# EAGLE design C-RIO_breakout (EAGLE 9.0.0)
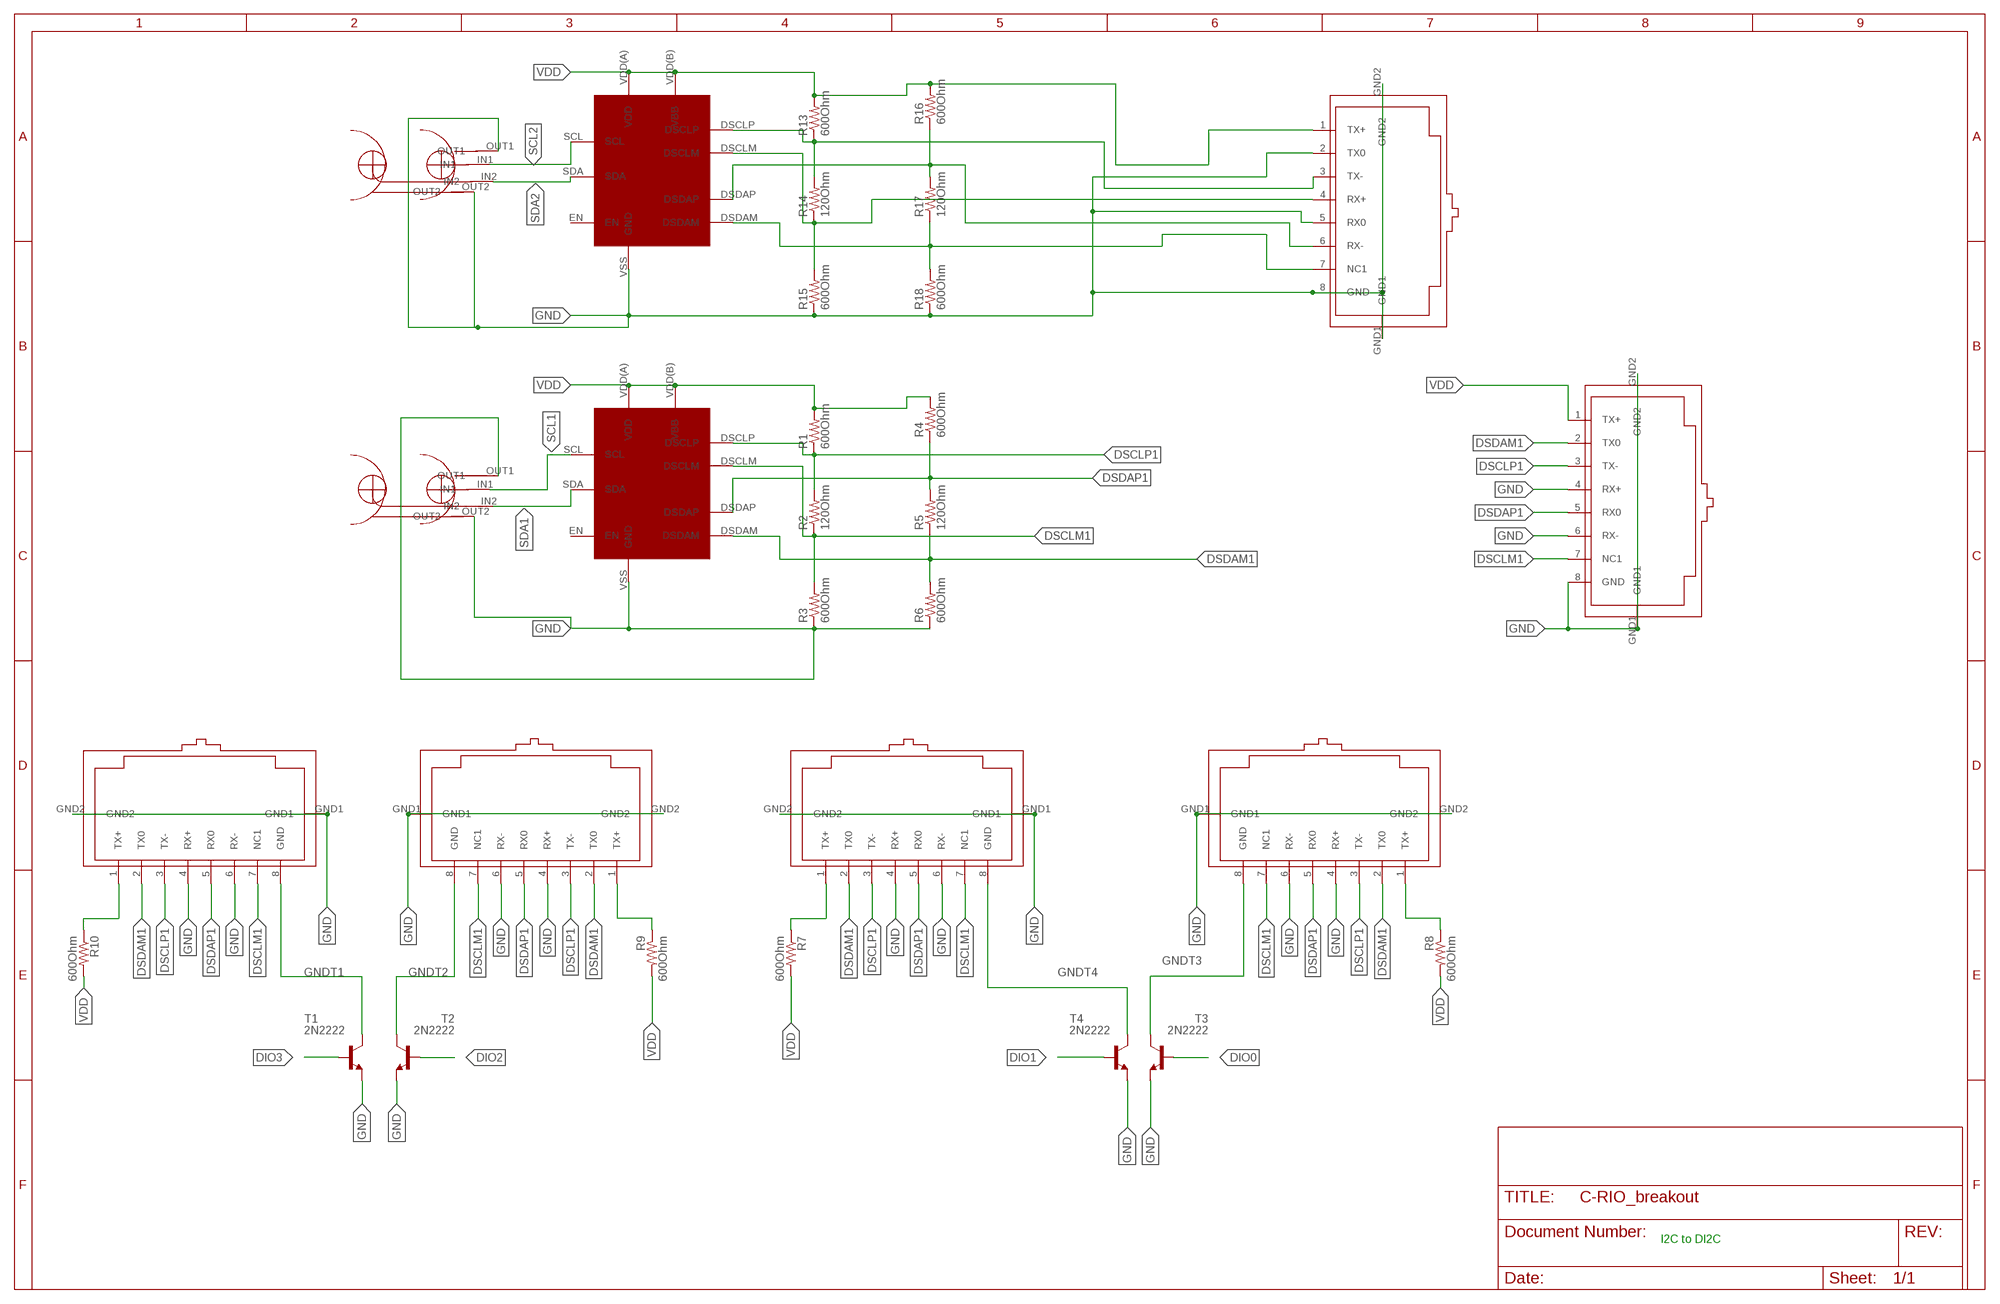
[diagram p0: schematic, sheet 1, part 1 of 2]
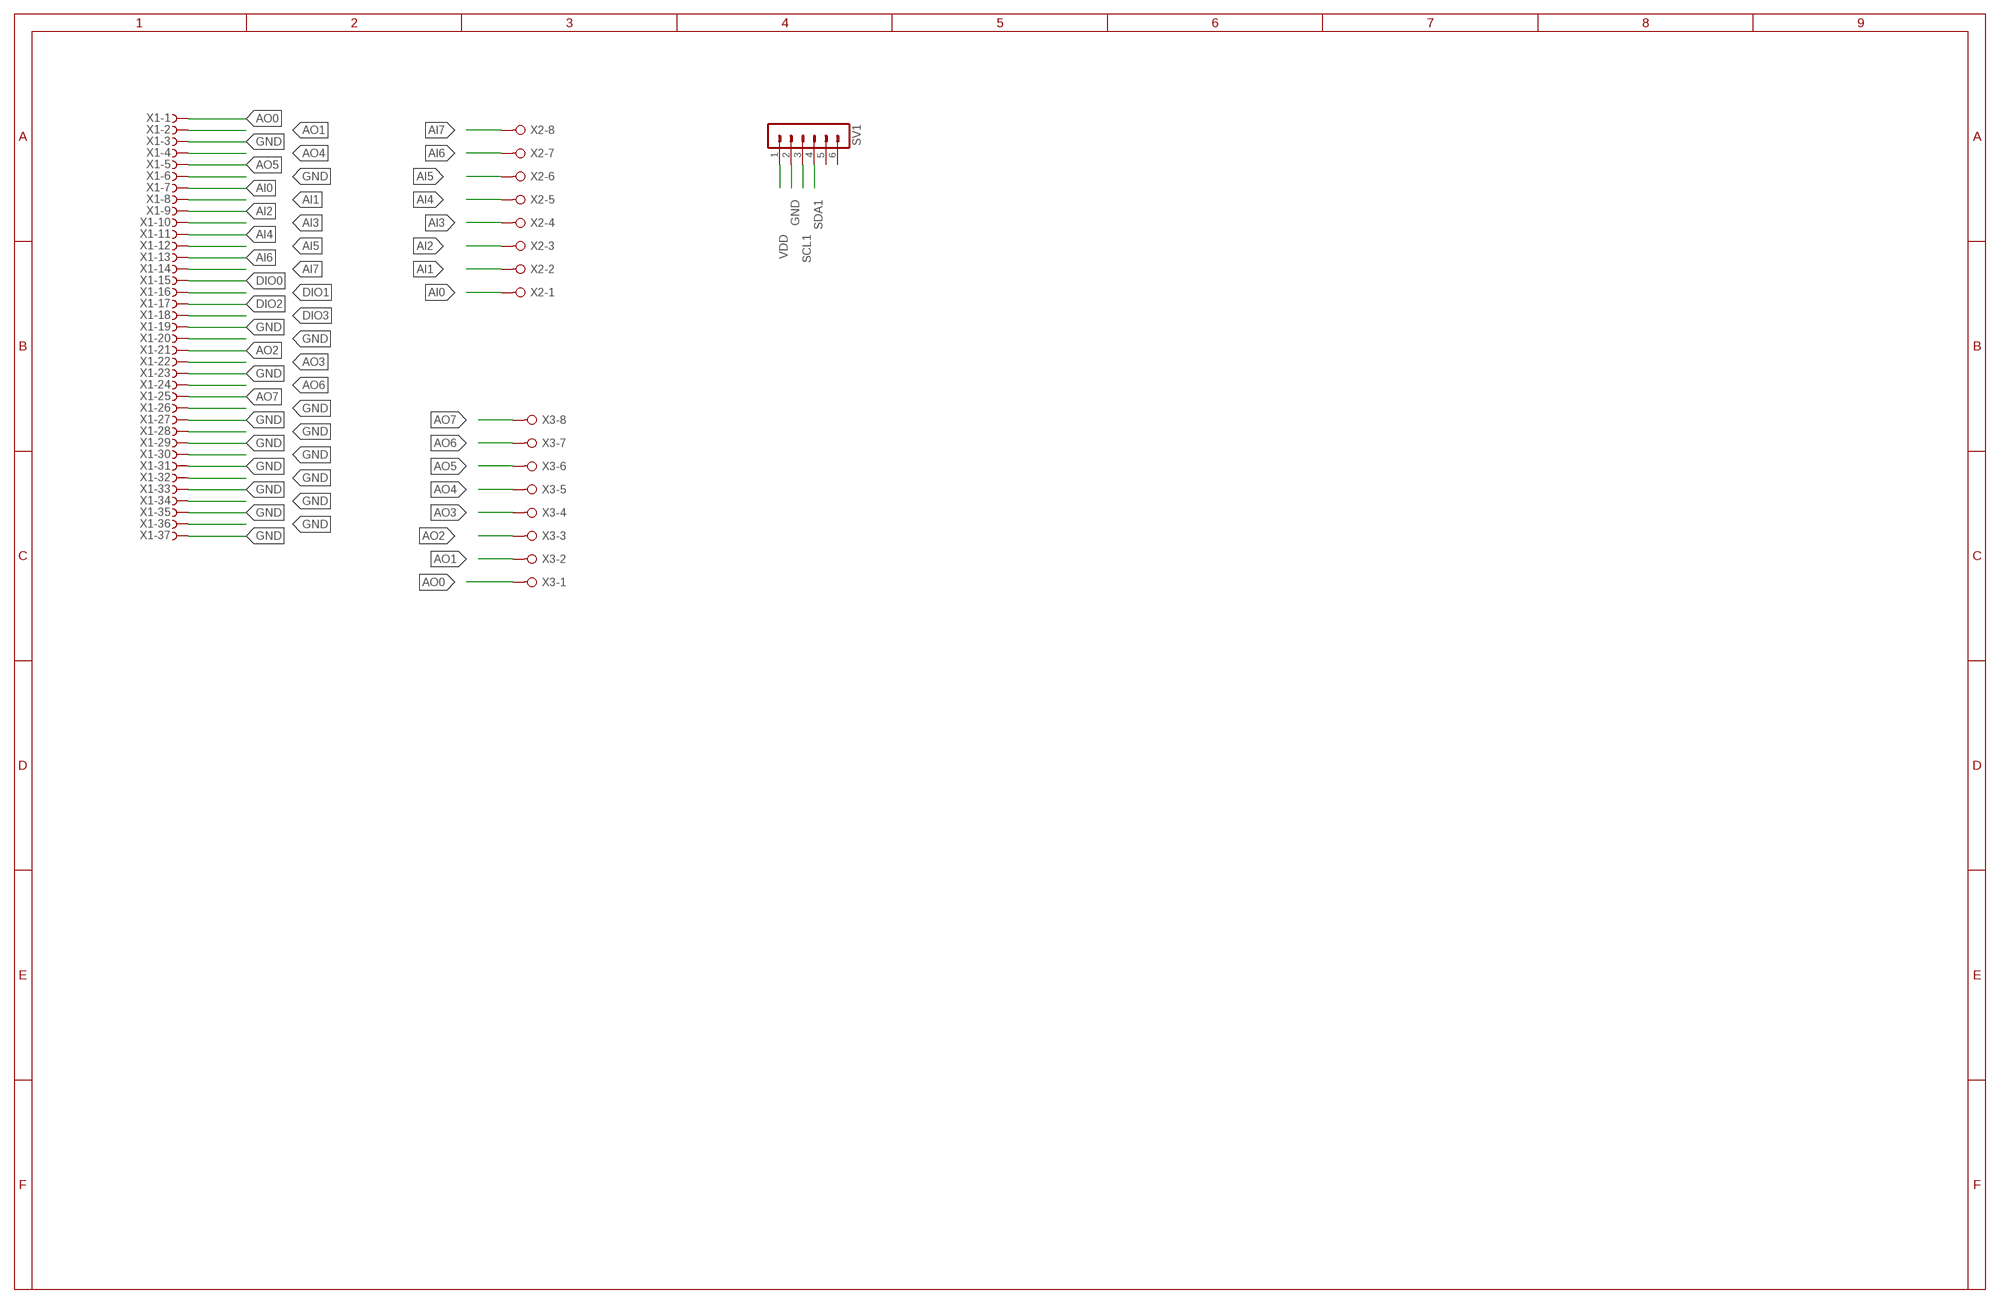
[diagram p1: schematic, sheet 1, part 2 of 2]

## Parts
COMMON  RJ45-8N4-B  [RJ45-8N4-B]
R1  600Ohm  R-US_0414/15  [0414/15]
R2  120Ohm  R-US_0414/15  [0414/15]
R3  600Ohm  R-US_0414/15  [0414/15]
R4  600Ohm  R-US_0414/15  [0414/15]
R5  120Ohm  R-US_0414/15  [0414/15]
R6  600Ohm  R-US_0414/15  [0414/15]
R7  600Ohm  R-US_0414/15  [0414/15]
R8  600Ohm  R-US_0414/15  [0414/15]
R9  600Ohm  R-US_0414/15  [0414/15]
R10  600Ohm  R-US_0414/15  [0414/15]
R13  600Ohm  R-US_0414/15  [0414/15]
R14  120Ohm  R-US_0414/15  [0414/15]
R15  600Ohm  R-US_0414/15  [0414/15]
R16  600Ohm  R-US_0414/15  [0414/15]
R17  120Ohm  R-US_0414/15  [0414/15]
R18  600Ohm  R-US_0414/15  [0414/15]
SV1  MA06-1  [MA06-1]
T1  2N2222  [TO18]
T2  2N2222  [TO18]
T3  2N2222  [TO18]
T4  2N2222  [TO18]
TOF1  RJ45-8N4-B  [RJ45-8N4-B]
TOF2  RJ45-8N4-B  [RJ45-8N4-B]
TOF3  RJ45-8N4-B  [RJ45-8N4-B]
TOF4  RJ45-8N4-B  [RJ45-8N4-B]
U$1  PCA9615  [PCA9615]
U$2  DUALBNC_CONNECTOR  [DUALBNC_CONNECTOR]
U$3  PCA9615  [PCA9615]
U$4  DUALBNC_CONNECTOR  [DUALBNC_CONNECTOR]
U$6  RJ45-8N4-B  [RJ45-8N4-B]
X1  F37HPS  [F37HP]
X2  W237-08P  [W237-8P]
X3  W237-08P  [W237-8P]

## Nets
AI0: X1.7 X2.1
AI1: X1.8 X2.2
AI2: X1.9 X2.3
AI3: X1.10 X2.4
AI4: X1.11 X2.5
AI5: X1.12 X2.6
AI6: X1.13 X2.7
AI7: X1.14 X2.8
AO0: X1.1 X3.1
AO1: X1.2 X3.2
AO2: X1.21 X3.3
AO3: X1.22 X3.4
AO4: X1.4 X3.5
AO5: X1.5 X3.6
AO6: X1.24 X3.7
AO7: X1.25 X3.8
DIO0: T3.2(B) X1.15
DIO1: T4.2(B) X1.16
DIO2: T2.2(B) X1.17
DIO3: T1.2(B) X1.18
DSCLM1: COMMON.7(NC1) R2.1 R3.2 TOF1.7(NC1) TOF2.7(NC1) TOF3.7(NC1) TOF4.7(NC1) U$1.DSCLM
DSCLP1: COMMON.3(TX-) R1.1 R2.2 TOF1.3(TX-) TOF2.3(TX-) TOF3.3(TX-) TOF4.3(TX-) U$1.DSCLP
DSDAM1: COMMON.2(TX0) R5.1 R6.2 TOF1.2(TX0) TOF2.2(TX0) TOF3.2(TX0) TOF4.2(TX0) U$1.DSDAM
DSDAP1: COMMON.5(RX0) TOF1.5(RX0) TOF2.5(RX0) TOF3.5(RX0) TOF4.5(RX0)
GND: COMMON.4(RX+) COMMON.6(RX-) COMMON.8(GND) COMMON.GND1 COMMON.GND2 R3.1 R6.1 R15.1 R18.1 SV1.2 T1.1(E) T2.1(E) T3.1(E) T4.1(E) TOF1.4(RX+) TOF1.6(RX-) TOF2.4(RX+) TOF2.6(RX-) TOF3.4(RX+) TOF3.6(RX-) TOF4.4(RX+) TOF4.6(RX-) U$1.VSS(GND) U$2.OUT1 U$2.OUT2 U$3.VSS(GND) U$4.OUT1 U$4.OUT2 U$6.2(TX0) U$6.5(RX0) U$6.8(GND) U$6.GND1 U$6.GND2 X1.3 X1.6 X1.19 X1.20 X1.23 X1.26 X1.27 X1.28 X1.29 X1.30 X1.31 X1.32 X1.33 X1.34 X1.35 X1.36 X1.37
GND2: TOF1.GND1 TOF1.GND2 TOF2.GND1 TOF2.GND2 TOF3.GND1 TOF3.GND2 TOF4.GND1 TOF4.GND2
GNDT1: T1.3(C) TOF4.8(GND)
GNDT2: T2.3(C) TOF3.8(GND)
GNDT3: T3.3(C) TOF1.8(GND)
GNDT4: T4.3(C) TOF2.8(GND)
N$4: R4.1 R5.2 U$1.DSDAP
N$11: R13.1 R14.2 U$3.DSCLP U$6.3(TX-)
N$12: R14.1 R15.2 U$3.DSCLM U$6.4(RX+)
N$15: R16.1 R17.2 U$3.DSDAP U$6.6(RX-)
N$16: R17.1 R18.2 U$3.DSDAM U$6.7(NC1)
SCL1: SV1.3 U$1.SCL U$4.IN1
SCL2: U$2.IN1 U$3.SCL
SDA1: SV1.4 U$1.SDA U$4.IN2
SDA2: U$2.IN2 U$3.SDA
VDD: COMMON.1(TX+) R1.2 R4.2 R7.1 R7.2 R8.1 R8.2 R9.1 R9.2 R10.1 R10.2 R13.2 R16.2 SV1.1 TOF1.1(TX+) TOF2.1(TX+) TOF3.1(TX+) TOF4.1(TX+) U$1.VDD(A)(VDD) U$1.VDD(B)(VBB) U$3.VDD(A)(VDD) U$3.VDD(B)(VBB) U$6.1(TX+)
Unconnected: SV1.5 SV1.6 U$1.EN U$3.EN

## Notes on the sheet
- I2C to DI2C

## Library data of the parts
COMMON TOF1-TOF4 U$6 = con-amphenol-rj45-ld:RJ45-8N4-B: RJ45 socket with integrated magnetics Naming: Amphenol LMJ1598824110DT39 TME RJ45-TRAFO Author: Petr Kalandra <mailto:kalandrap@gmail.com> Datasheet: http://zefiryn.tme.pl/dok/zlacza/rjtrafo.pdf
R1-R10 R13-R18 = resistor:R-US_: RESISTOR, American symbol
SV1 = con-lstb:MA06-1: PIN HEADER; OC_FARNELL: unknown; OC_NEWARK: unknown
T1-T4 = transistor-neu-to92:2N2222: NPN TRANSISTOR
U$1 U$3 = PCA9615:PCA9615
U$2 U$4 = PCA9615:DUALBNC_CONNECTOR
X1 = con-subd:F37?S: SUB-D; OC_FARNELL: unknown; OC_NEWARK: unknown
X2 X3 = con-wago-508:W237-08P: WAGO SREW CLAMP; OC_FARNELL: unknown; OC_NEWARK: unknown

## Net classes
0 VDD: width 0.178 mm, drill 0.127 mm, clearance 0.127 mm
1 GND: width 0.178 mm, drill 0.127 mm, clearance 0.127 mm to class 0, clearance 0.127 mm

## Board
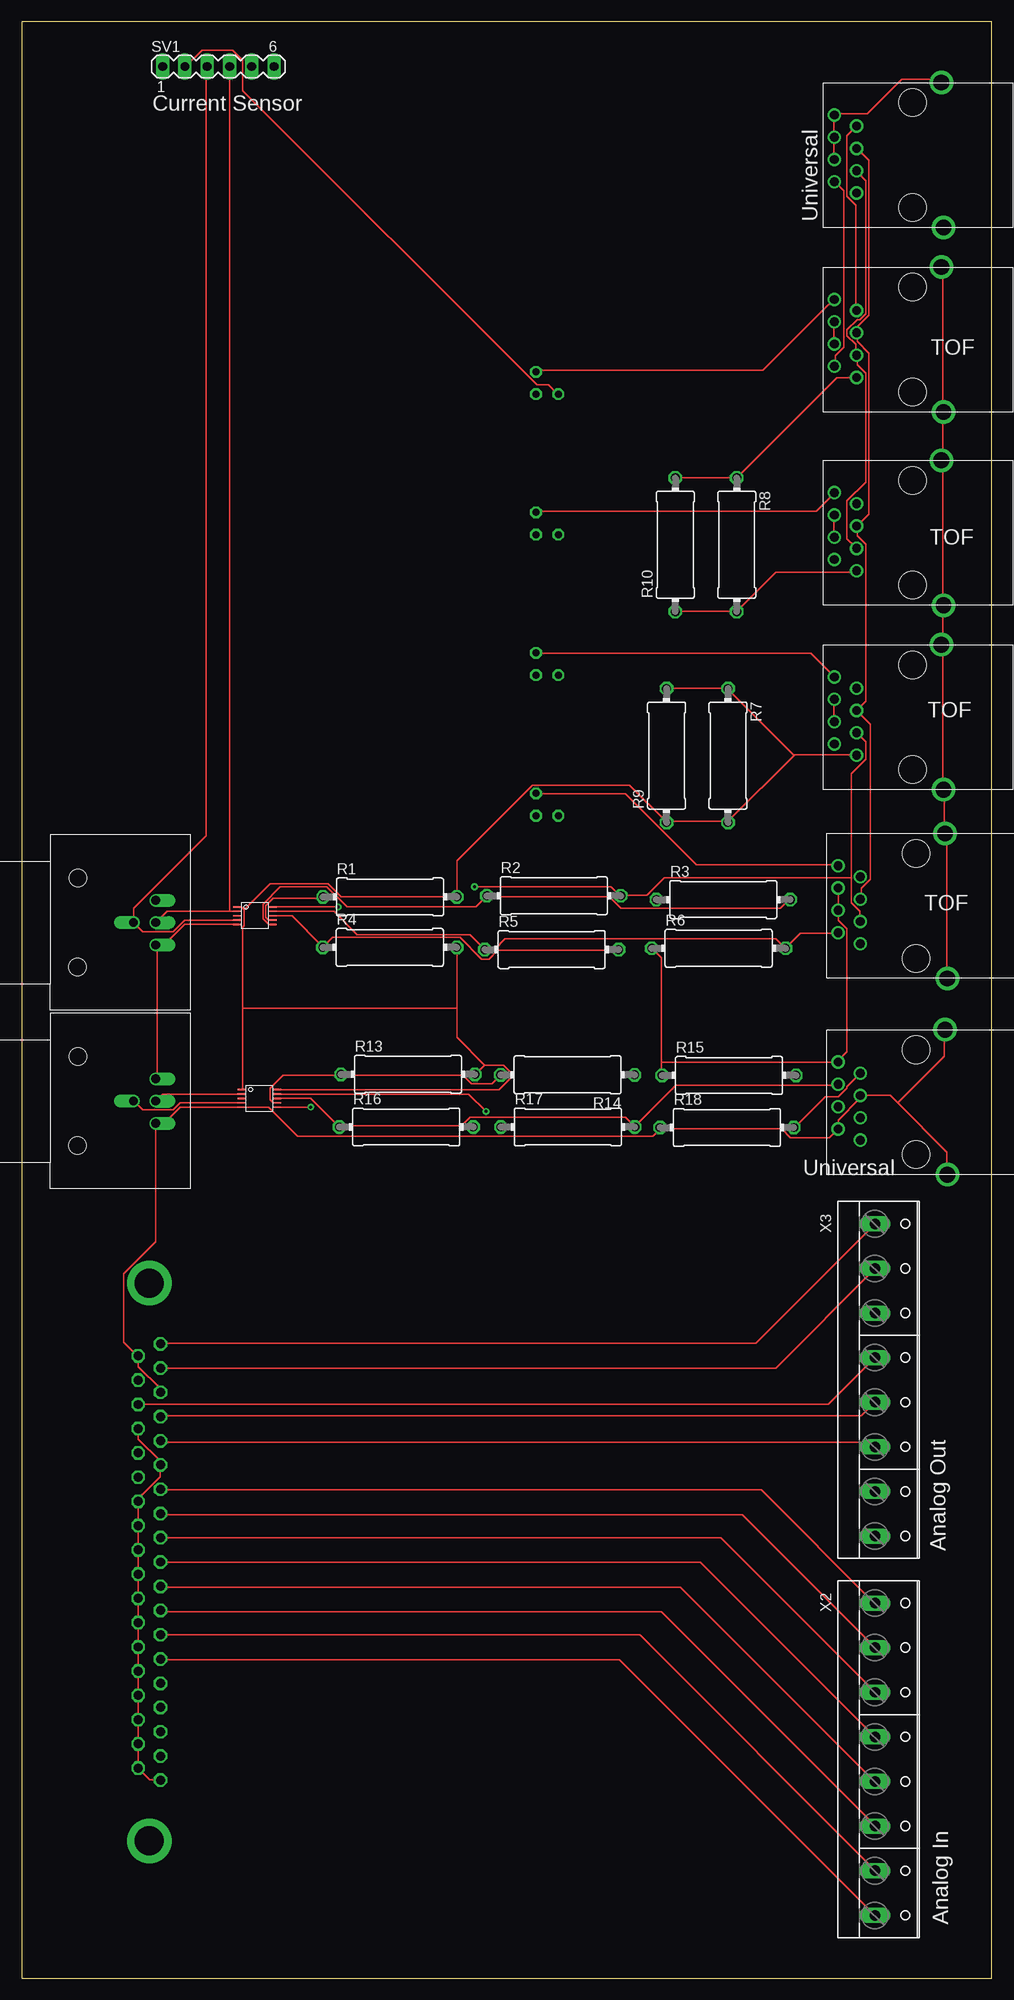
[diagram p2: board, top side]
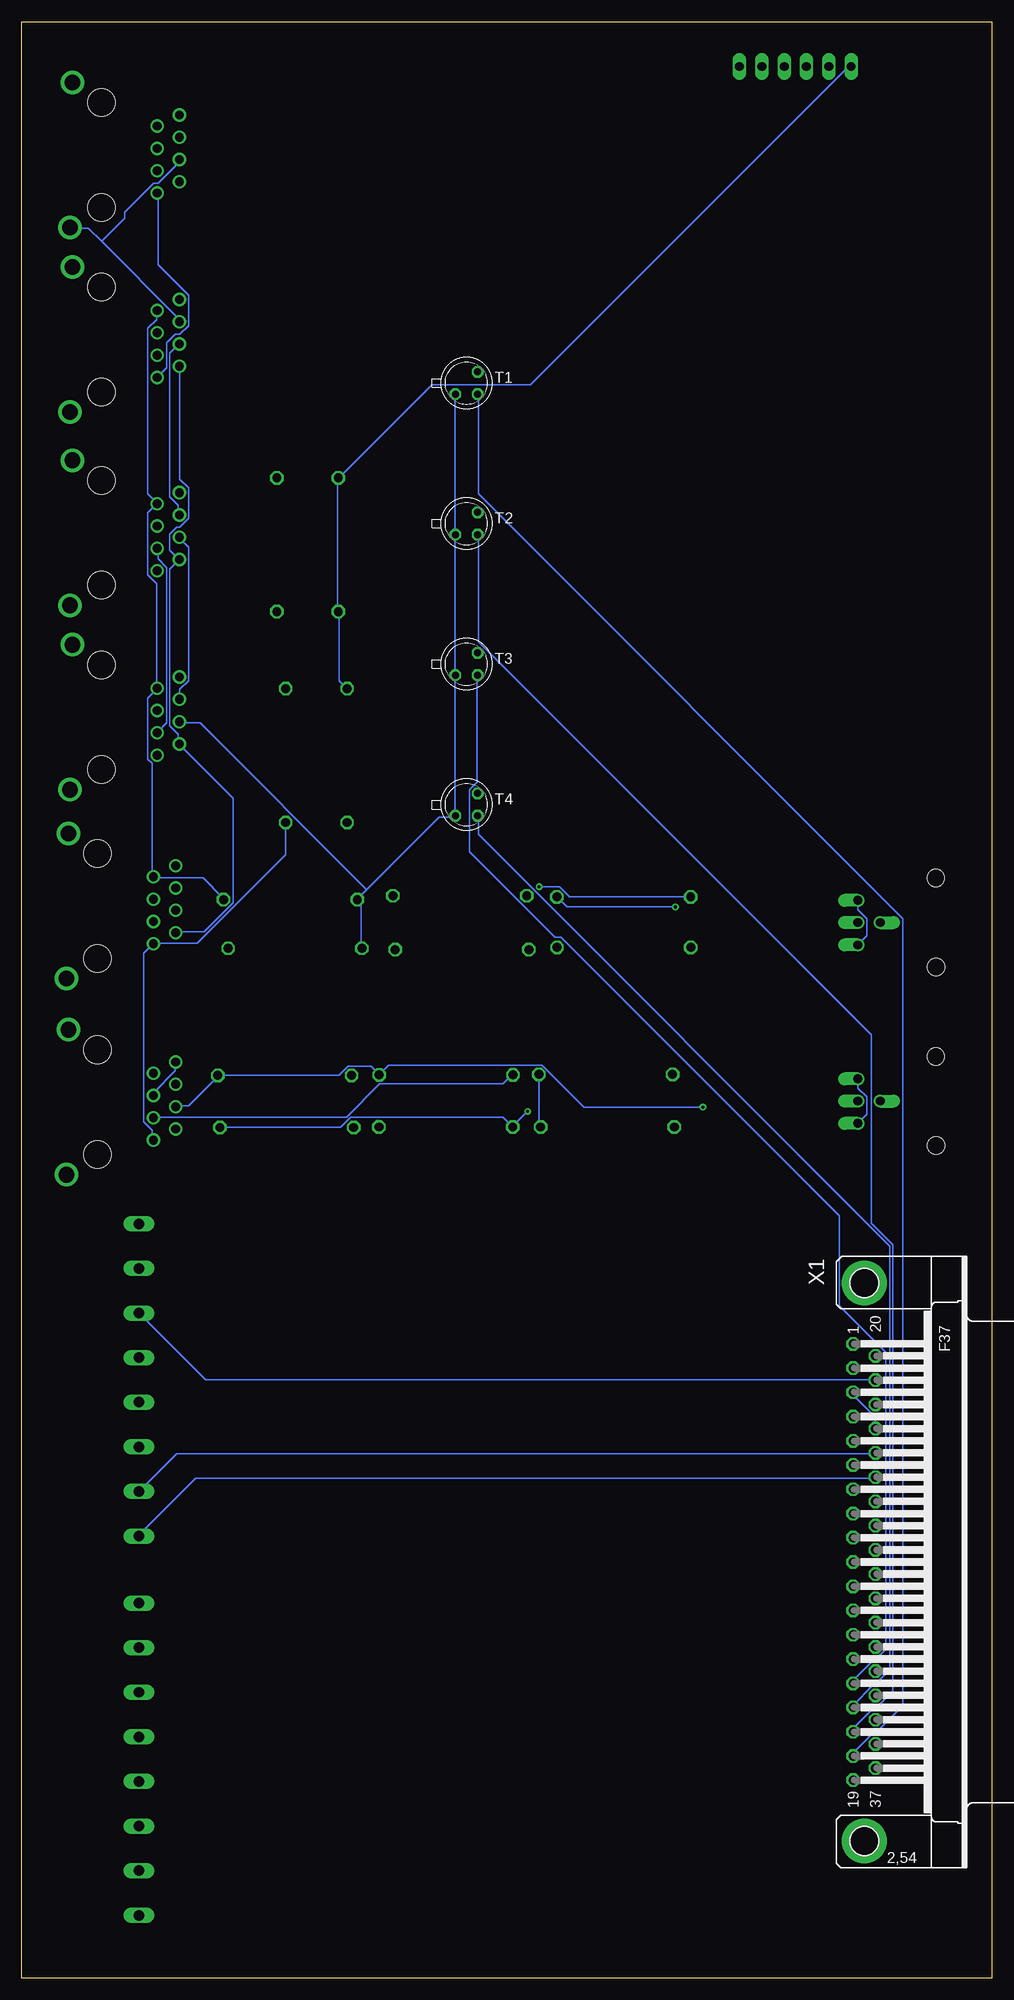
[diagram p3: board, bottom side, seen from below]

Size 110.47 x 222.72 mm. Coordinates in mm from the lower left corner, seen from the top.
Outline: 0,0 110.47,0 110.47,222.72 0,222.72 0,0
Copper layers (1*16): Top 0.035mm / dielectric 1.5mm / Bottom 0.035mm
Design rules "default *": minimum track width 2mil, minimum drill 0.35mm, track to track 6mil, track to pad 6mil, pad to pad 6mil, via to via 6mil, smd to smd 6mil, copper to edge 40mil, drill to drill 6mil, minimum pad ring 10mil, minimum via ring 8mil, stop-mask expansion 4mil, vias tented up to drill 0mil, thermal gap 10mil

### Footprints (pad centres in the part's own frame; a part is rotated, then mirrored left to right if it is on the bottom)
RJ45-8N4-B = drill 1: 1 -4.953,6.35; 2 -3.683,8.89; 3 -2.413,6.35; 4 -1.143,8.89; 5 0.127,6.35; 6 1.397,8.89; 7 2.667,6.35; 8 3.937,8.89 | drill 1.786: GND1 -8.89,-3.556; GND2 7.62,-3.302 | hole 3.149: -6.604,0; 5.334,0
0414/15 = drill 1.016 octagon: 1 -7.62,0; 2 7.62,0
MA06-1 = drill 1.016 long: 1 -6.35,0; 2 -3.81,0; 3 -1.27,0; 4 1.27,0; 5 3.81,0; 6 6.35,0
TO18 = drill 0.813 octagon: 1 -1.27,-1.27; 2 1.27,-1.27; 3 1.27,1.27
PCA9615 = smd 0.95 x 0.15: DSCLM 2,-1; DSCLP 2,-0.5; DSDAM 2,0.5; DSDAP 2,0; EN -2,0; SCL -2,-0.5; SDA -2,0.5; VDD(A) -2,1; VDD(B) 2,1; VSS -2,-1
DUALBNC_CONNECTOR = drill 1 pad 1.27 offset: IN1 2.54,0; IN2 0,0; OUT1 0,-2.54; OUT2 0,2.54 | hole 2: 8.905,5.075; 8.871,-5.075
F37HP = drill 1.016 octagon: 1 -24.841,-1.27; 2 -22.073,-1.27; 3 -19.329,-1.27; 4 -16.561,-1.27; 5 -13.792,-1.27; 6 -11.049,-1.27; 7 -8.28,-1.27; 8 -5.512,-1.27; 9 -2.769,-1.27; 10 0,-1.27; 11 2.769,-1.27; 12 5.512,-1.27; 13 8.28,-1.27; 14 11.049,-1.27; 15 13.818,-1.27; 16 16.561,-1.27; 17 19.329,-1.27; 18 22.098,-1.27; 19 24.841,-1.27; 20 -23.47,1.27; 21 -20.701,1.27; 22 -17.932,1.27; 23 -15.189,1.27; 24 -12.421,1.27; 25 -9.652,1.27; 26 -6.909,1.27; 27 -4.14,1.27; 28 -1.372,1.27; 29 1.372,1.27; 30 4.14,1.27; 31 6.909,1.27; 32 9.677,1.27; 33 12.421,1.27; 34 15.189,1.27; 35 17.958,1.27; 36 20.701,1.27; 37 23.47,1.27 | drill 3.302 pad 5.08: G1 -31.75,0; G2 31.75,0
W237-8P = drill 1.194 long: 1 -17.78,-0.635; 2 -12.7,-0.635; 3 -7.62,-0.635; 4 -2.54,-0.635; 5 2.54,-0.635; 6 7.62,-0.635; 7 12.7,-0.635; 8 17.78,-0.635

### Placement (x,y rotation side)
COMMON  101.43,208.19 90 top
R1  41.92,123.09 0 top
R2  60.59,123.22 0 top
R3  79.89,122.79 0 top
R4  41.9,117.34 0 top
R5  60.34,117.1 0 top
R6  79.36,117.25 0 top
R7  80.43,139.19 270 top
R8  81.43,163.19 270 top
R9  73.43,139.19 90 top
R10  74.43,163.19 90 top
R13  43.97,102.9 0 top
R14  62.16,102.84 180 top
R15  80.54,102.77 0 top
R16  43.77,96.9 0 top
R17  62.19,96.9 0 top
R18  80.31,96.84 0 top
SV1  22.37,217.64 0 top
T1  59.83,181.61 0 bottom
T2  59.83,165.61 0 bottom
T3  59.83,149.61 0 bottom
T4  59.83,133.61 0 bottom
TOF1  101.43,144.19 90 top
TOF2  101.85,122.71 90 top
TOF3  101.43,165.19 90 top
TOF4  101.43,187.19 90 top
U$1  26.55,120.96 0 top
U$2  15.24,99.85 180 top
U$3  27.04,100.16 0 top
U$4  15.24,120.17 180 top
U$6  101.85,100.36 90 top
X1  14.51,47.37 270 bottom
X2  97.79,24.92 270 top
X3  97.79,68.1 270 top

### Tracks (layer width: path | path; a pad name or v marks a point on that pad's centre or on a via)
AI0
  Top 0.178: X1.7 15.89,55.58 84.24,55.58 97.12,42.7 X2.1
AI1
  Top 0.178: X1.8 15.89,52.77 82.09,52.77 97.12,37.75 X2.2
AI2
  Top 0.178: X1.9 15.89,50.13 79.62,50.13 97.12,32.63 X2.3
AI3
  Top 0.178: X1.10 15.89,47.32 77.31,47.32 97.12,27.51 X2.4
AI4
  Top 0.178: X1.11 15.89,44.52 74.99,44.52 97.12,22.39 X2.5
AI5
  Top 0.178: X1.12 15.89,41.71 72.85,41.71 97.12,17.44 X2.6
AI6
  Top 0.178: X1.13 15.89,39.07 70.37,39.07 97.12,12.32 X2.7
AI7
  Top 0.178: X1.14 15.89,36.26 68.06,36.26 97.12,7.2 X2.8
AO0
  Top 0.178: X1.1 15.89,72.25 83.58,72.25 97.12,85.79 X3.1
AO1
  Top 0.178: X1.2 15.89,69.45 85.89,69.45 97.12,80.67 X3.2
AO2
  Bottom 0.178: X1.21 13.25,68.12 89.52,68.12 97.12,75.72 X3.3
AO3
  Top 0.178: X3.4 91.83,65.32 13.25,65.32 X1.22
AO4
  Top 0.178: X1.4 15.89,64 95.63,64 97.12,65.48 X3.5
AO5
  Top 0.178: X1.5 15.89,61.03 96.62,61.03 97.12,60.53 X3.6
AO6
  Bottom 0.178: X1.24 13.25,59.7 92.82,59.7 97.12,55.41 X3.7
AO7
  Bottom 0.178: X1.25 13.25,56.9 90.68,56.9 97.12,50.46 X3.8
DIO0
  Bottom 0.178: T3.2 58.65,148.2 58.65,136.15 59.47,135.32 59.47,128.22 49.73,118.48 49.07,118.48 17.37,86.78 17.37,76.55 12.09,71.26 12.09,37.42 13.41,36.1 13.58,36.1 15.72,33.95 15.72,33.62 X1.15
DIO1
  Bottom 0.178: T4.2 58.48,132.18 58.48,130.2 11.59,83.31 11.59,35.11 13.41,33.29 13.58,33.29 15.72,31.14 15.72,30.81 X1.16
DIO2
  Bottom 0.178: T2.2 58.48,164.21 58.48,152.16 13.74,107.42 13.74,85.96 11.27,83.48 11.27,32.63 13.41,30.48 13.74,30.48 15.72,28.5 15.72,28.17 X1.17
DIO3
  Bottom 0.178: T1.2 58.48,180.23 58.48,169 10.11,120.63 10.11,30.98 13.41,27.68 13.74,27.68 15.72,25.7 15.72,25.36 X1.18
DSCLM1
  Top 0.178: U$1.DSCLM 28.43,119.97 28.11,119.97 27.45,120.63 27.45,122.28 29.43,124.26 34.71,124.26 37.02,121.95 51.71,121.95 52.87,123.1 R2.1 53.03,123.1 66.9,123.1 68.22,121.78 86.38,121.78 87.38,122.77 R3.2 | TOF4.7 94.97,189.97 94.97,201.86 93.98,202.85 93.98,209.78 94.97,210.77 COMMON.7
  Bottom 0.178: R3.2 87.54,122.94 89.85,125.25 95.47,125.25 TOF2.7 95.63,125.41 95.63,138.29 96.13,138.79 96.13,145.72 95.14,146.71 TOF1.7 95.14,146.88 95.14,158.76 96.13,159.76 96.13,166.85 95.14,167.85 TOF3.7 95.14,168.01 96.13,169 96.13,187.82 95.14,188.81 95.14,189.8 TOF4.7
DSCLP1  (via drill 0.35)
  Top 0.178: COMMON.3 95.14,205.65 96.13,204.66 96.13,189.47 95.47,188.81 95.14,188.81 93.98,187.66 93.98,187 94.97,186.01 94.97,184.85 TOF4.3 95.14,184.69 95.14,183.69 96.13,182.7 96.13,170.32 93.98,168.18 93.98,163.88 94.97,162.89 TOF3.3 | U$1.DSCLP 28.43,120.46 28.11,120.46 27.77,120.79 27.77,122.11 28.6,122.94 34.21,122.94 R1.1 | 94.47,125.25 94.47,137.14 96.13,138.79 96.13,140.77 95.14,141.76 TOF1.3 | 94.47,125.25 94.47,122.44 95.47,121.45 95.47,120.3 TOF2.3 | 94.47,125.25 73.18,125.25 71.2,123.27 68.22,123.27 R2.2 68.06,123.27 67.07,124.26 v51.55,124.26
  Bottom 0.178: TOF3.3 94.97,162.73 94.97,161.57 93.98,160.58 93.98,142.92 94.97,141.93 TOF1.3 | v51.55,124.26 49.24,124.26 48.08,123.1 34.38,123.1 R1.1
DSDAM1
  Top 0.178: U$1.DSDAM 28.6,121.45 35.53,121.45 38.18,118.81 51.05,118.81 52.7,117.16 R5.1 52.87,117.16 53.86,117.16 55.02,118.32 85.89,118.32 86.88,117.33 R6.2 87.05,117.33 88.7,118.98 92.82,118.98 TOF2.2 | TOF4.2 92.66,183.53 92.66,184.69 93.65,185.68 93.65,203.51 92.66,204.5 COMMON.2
  Bottom 0.178: TOF2.2 92.82,119.14 89.69,119.14 86.38,122.44 86.38,134.33 92.49,140.44 TOF1.2 92.66,140.6 92.66,141.59 93.65,142.59 93.65,160.42 92.66,161.41 TOF3.2 92.66,161.57 93.65,162.56 93.65,164.38 92.82,165.2 92.49,165.2 91.5,166.19 91.5,169.66 92.49,170.65 92.49,183.37 TOF4.2
DSDAP1
  Top 0.178: COMMON.5 95.14,208.29 96.46,206.97 96.46,189.31 95.14,187.99 95.14,187.33 TOF4.5 95.14,187.16 95.14,186.34 96.46,185.02 96.46,166.69 95.14,165.37 TOF3.5 95.14,165.2 95.14,164.21 96.13,163.22 96.13,145.39 95.14,144.4 TOF1.5 95.14,144.24 96.62,142.75 96.62,125.08 95.63,124.09 95.63,122.94 TOF2.5
GND
  Top 0.178: U$1.VSS 24.47,119.97 18.53,119.97 16.22,117.66 15.39,117.66 U$4.OUT2 15.39,117.49 15.39,102.47 U$2.OUT1 | X1.19 15.72,22.56 14.57,22.56 13.25,23.88 X1.37 13.25,24.04 13.25,26.52 X1.36 13.25,26.69 13.25,29.33 X1.35 13.25,29.49 13.25,32.13 X1.34 13.25,32.3 X1.33 13.25,35.11 13.25,37.58 X1.32 13.25,37.75 13.25,40.39 X1.31 13.25,40.55 13.25,43.2 X1.30 13.25,43.36 13.25,45.84 X1.29 13.25,48.64 X1.28 13.25,48.81 13.25,51.45 X1.27 13.25,51.62 13.25,54.26 X1.26 13.08,54.42 15.72,57.06 15.72,58.38 X1.6 15.72,58.55 15.72,58.88 13.25,61.36 13.25,62.51 X1.23 | X1.3 15.72,66.81 15.72,67.14 13.25,69.61 13.25,70.77 X1.20 13.08,70.93 11.59,72.42 11.59,80.18 15.23,83.81 15.23,97.18 U$2.OUT2 15.39,97.35 16.22,97.35 18.03,99.16 24.97,99.16 U$3.VSS 25.13,99.16 28.11,99.16 31.41,95.86 71.86,95.86 72.68,96.69 R18.1 72.85,96.69 86.55,96.69 87.54,95.7 92,95.7 92.82,96.52 U$6.2 92.99,96.69 92.99,97.68 95.47,100.16 95.47,100.48 U$6.5 98.93,100.48 99.76,99.66 | COMMON.4 92.49,207.14 92.49,209.45 COMMON.6 92.49,209.62 92.49,212.09 COMMON.8 92.66,212.26 96.29,212.26 100.25,216.22 104.38,216.22 104.71,215.89 COMMON.GND2 | TOF1.4 92.49,143.08 92.49,145.56 TOF1.6 | TOF3.4 92.49,164.05 92.49,166.53 TOF3.6 | TOF4.4 92.49,186.17 92.49,188.48 TOF4.6 | TOF2.6 92.99,124.09 92.99,121.62 TOF2.4 92.99,121.45 92.99,120.46 93.98,119.47 93.98,105.44 92.99,104.45 U$6.8 92.82,104.28 72.85,104.28 | 99.76,99.66 105.37,94.05 105.37,91.57 U$6.GND1 | 99.76,99.66 105.04,104.94 105.04,107.91 U$6.GND2 | 72.85,104.28 72.85,116.17 71.86,117.16 R6.1 | 72.85,104.28 72.85,102.8 R15.1
  Top 0.178: SV1.2 18.69,217.71 20.51,219.52 23.98,219.52 25.13,218.37 25.13,214.9 58.65,181.38 59.97,181.38 60.96,180.39 T1.1
  Bottom 0.178: U$4.OUT1 15.23,122.61 15.23,121.62 14.24,120.63 14.24,118.65 15.23,117.66 U$4.OUT2 | U$2.OUT1 15.23,102.3 15.23,101.31 14.24,100.32 14.24,98.34 15.23,97.35 U$2.OUT2 | X1.23 13.25,62.68 13.25,63.83 15.72,66.31 15.72,66.64 X1.3 | TOF1.6 92.49,145.72 92.49,146.71 91.5,147.7 91.5,162.89 92.49,163.88 TOF3.4 | 101.41,197.73 102.9,199.22 104.88,199.22 COMMON.GND1 | 101.41,197.73 92.66,188.98 92.66,188.65 TOF4.6 | TOF3.6 92.66,166.69 92.66,167.68 93.65,168.67 93.65,185.02 92.66,186.01 TOF4.4 | 101.41,197.73 98.77,200.37 98.77,201.03 95.47,204.33 94.97,204.33 92.66,206.64 92.66,206.97 COMMON.4 | U$6.8 92.99,104.28 92.99,103.29 95.47,100.81 95.47,100.48 U$6.5 | 71.2,123.93 72.19,122.94 R3.1 72.19,122.77 71.86,122.44 71.86,117.33 R6.1 | 71.2,123.93 62.94,132.18 61.12,132.18 T4.1 61.12,132.35 61.12,148.2 T3.1 61.12,148.36 61.12,164.21 T2.1 61.12,164.38 61.12,180.23 T1.1 | 71.2,123.93 90.18,142.92 92.49,142.92 TOF1.4
GND2
  Top 0.178: TOF4.GND2 104.88,194.76 104.88,178.41 TOF4.GND1 104.88,178.25 104.88,172.96 TOF3.GND2 104.88,172.8 104.88,156.45 TOF3.GND1 104.88,156.29 104.88,151.83 TOF1.GND2 104.88,151.67 104.88,135.32 TOF1.GND1 105.04,135.16 105.04,130.37 TOF2.GND2 105.21,130.2 105.37,130.04 105.37,113.86 TOF2.GND1
GNDT1
  Top 0.178: T1.3 58.65,183.03 84.4,183.03 92.49,191.12 TOF4.8
GNDT2
  Top 0.178: T2.3 58.65,167.02 90.51,167.02 92.49,169 TOF3.8
GNDT3
  Top 0.178: T3.3 58.65,150.84 89.85,150.84 92.49,148.2 TOF1.8
GNDT4
  Top 0.178: T4.3 58.65,134.83 68.72,134.83 76.81,126.74 92.82,126.74 TOF2.8
N$4
  Top 0.178: U$1.DSDAP 28.6,120.96 30.75,120.96 34.21,117.49 R4.1 34.38,117.49 35.37,118.48 49.9,118.48 52.38,116 53.2,116 54.19,117 67.89,117 R5.2
N$11
  Top 0.178: U$3.DSCLP 28.93,99.66 28.6,99.66 28.27,99.99 28.27,101.31 29.76,102.8 36.2,102.8 R13.1 36.36,102.8 50.23,102.8 51.22,101.81 53.53,101.81 54.52,102.8 R14.2
  Bottom 0.178: U$6.3 95.47,98.01 73.51,98.01 69.71,101.81 55.68,101.81 54.69,102.8 R14.2
N$12  (via drill 0.35)
  Top 0.178: v32.89,99.16 29.1,99.16 U$3.DSCLM
  Bottom 0.178: U$6.4 92.82,99.33 91.5,99.33 88.2,102.63 R15.2 88.04,102.8 74.33,102.8 73.34,103.79 70.7,103.79 69.88,102.96 R14.1 69.71,102.96 68.72,103.95 51.22,103.95 46.43,99.16 v32.89,99.16
N$15
  Top 0.178: U$3.DSDAP 29.1,100.16 32.89,100.16 36.03,97.02 R16.1 36.2,97.02 50.06,97.02 51.05,98.01 68.72,98.01 69.71,97.02 R17.2 69.88,97.02 74.5,101.64 92.82,101.64 U$6.6
N$16  (via drill 0.35)
  Top 0.178: U$6.7 95.47,102.96 93.98,101.48 93.98,101.31 92.99,100.32 91.5,100.32 88.04,96.85 R18.2 | v52.87,98.67 50.89,100.65 29.1,100.65 U$3.DSDAM
  Bottom 0.178: v52.87,98.67 54.52,97.02 R17.1 54.69,97.02 55.68,98.01 73.01,98.01 74.17,96.85 87.87,96.85 R18.2
SCL1
  Top 0.178: U$1.SCL 24.47,120.46 18.53,120.46 17.21,119.14 13.74,119.14 12.75,120.13 U$4.IN1 12.75,120.3 12.75,121.78 21.01,130.04 21.01,217.54 SV1.3
SCL2
  Top 0.178: U$3.SCL 24.97,99.66 18.03,99.66 17.21,98.83 13.74,98.83 12.75,99.83 U$2.IN1
SDA1
  Top 0.178: 23.65,121.45 16.55,121.45 15.39,120.3 U$4.IN2 | 23.65,121.45 24.47,121.45 U$1.SDA | 23.65,121.45 23.65,217.54 SV1.4
SDA2
  Top 0.178: U$3.SDA 24.97,100.65 16.05,100.65 15.39,99.99 U$2.IN2
VDD  (via drill 0.35)
  Top 0.178: TOF4.1 94.97,182.21 92.82,182.21 R8.1 81.27,170.82 74.5,170.82 R10.2 | v36.03,121.95 28.6,121.95 U$1.VDD(B) | 25.13,110.39 25.13,119.64 25.3,119.8 25.3,121.62 | 25.13,110.39 25.13,101.14 U$3.VDD(A) | 25.3,121.62 24.97,121.95 24.64,121.95 U$1.VDD(A) | 52.7,103.95 54.85,103.95 55.68,103.13 55.68,102.47 54.36,101.14 29.1,101.14 U$3.VDD(B) | 52.7,103.95 51.71,102.96 R13.2 | 49.57,110.39 49.57,107.09 52.7,103.95 | 49.57,110.39 49.57,117.33 R4.2 | 49.57,110.39 25.13,110.39 | 25.3,121.62 28.27,124.59 34.87,124.59 36.36,123.1 49.4,123.1 R1.2 49.57,123.1 49.57,127.23 58.15,135.82 69.22,135.82 73.34,131.69 R9.1 73.51,131.69 80.28,131.69 R7.2 80.44,131.69 88.04,139.28 | TOF3.1 94.97,160.09 85.89,160.09 81.43,155.63 R8.2 81.27,155.63 74.5,155.63 R10.1 | 88.04,139.28 87.87,139.28 80.44,146.71 R7.1 80.28,146.88 73.51,146.88 R9.2 | 88.04,139.28 94.97,139.28 TOF1.1
  Bottom 0.178: COMMON.1 94.97,203.18 94.97,195.09 91.5,191.62 91.5,188.15 92.49,187.16 92.99,187.16 93.98,186.17 93.98,183.37 94.97,182.38 TOF4.1 | SV1.1 16.05,217.54 16.38,217.54 52.54,181.38 63.77,181.38 74.33,170.82 R10.2 74.5,170.65 74.5,155.63 R10.1 74.33,155.46 74.33,147.7 73.51,146.88 R9.2 | v36.03,121.95 48.41,121.95 49.4,122.94 R1.2 | R16.2 51.55,97.02 51.55,102.8 R13.2 | U$6.1 95.63,95.53 95.63,96.52 96.62,97.51 96.62,116.66 95.63,117.66 TOF2.1 95.47,117.82 90.51,117.82 80.44,127.89 80.44,131.52 R7.2

### Text on the board
tNames: Current Sensor | Universal | TOF | TOF | TOF | TOF | Universal | Analog Out | Analog In